# Altium schematic sheet 05_CONNECTOR_IN.SchDoc
size 420 x 297 mm; SheetNumber: 5; SheetTotal: 33
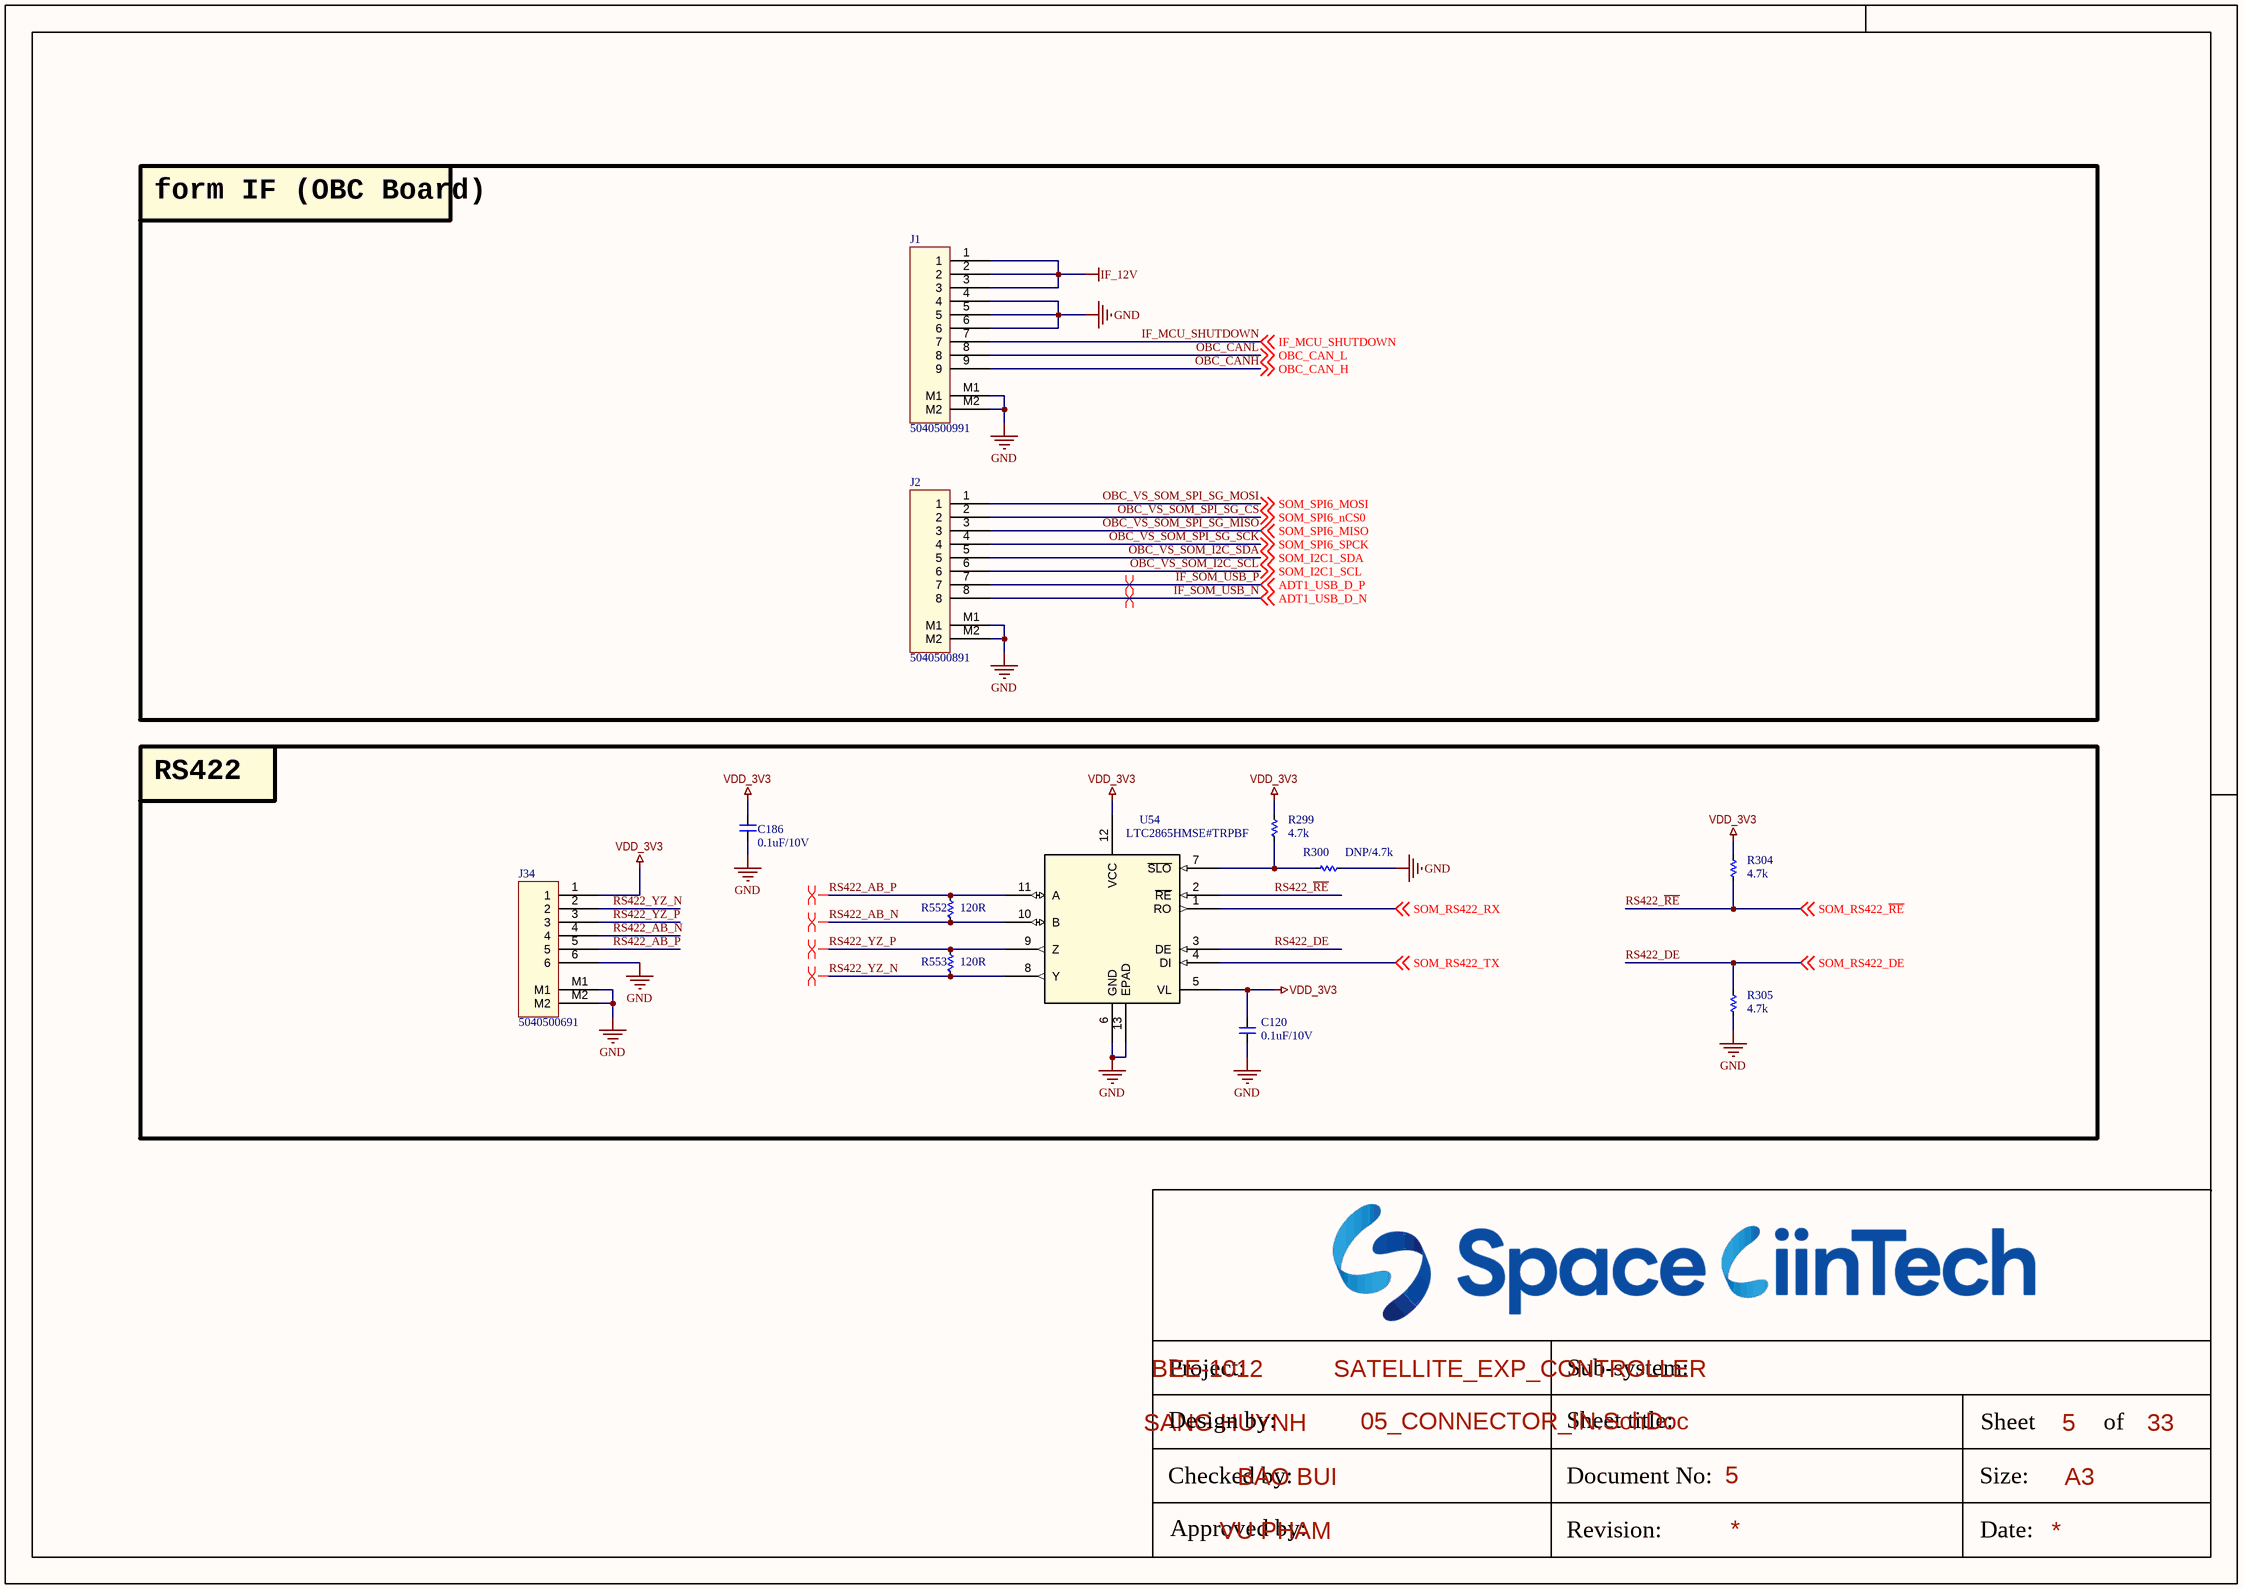
[diagram p0: 05_CONNECTOR_IN.SchDoc]

## Parts
C120  0.1uF/10V  [CAP_C_1005X50_L]
C186  0.1uF/10V  [CAP_C_1005X50_L]
J1  5040500991  [MOLEX_5040500991]
J2  5040500891  [MOLEX_5040500891]
J34  5040500691  [MOLEX_5040500691]
R299  4.7k  [RES_C_1005x30_L]
R300  DNP/4.7k  [RES_C_1005x30_L]
R304  4.7k  [RES_C_1005x30_L]
R305  4.7k  [RES_C_1005x30_L]
R552  120R  [RES_C_1005x30_L]
R553  120R  [RES_C_1005x30_L]
U54  LTC2865HMSE#TRPBF  [MSOP-12_MSE_LIT]

## Blocks framed on the sheet
form IF (OBC Board): J1 J2
RS422: C120 C186 J34 R299 R300 R304 R305 R552 R553 U54

## Nets
GND: C120.1 C186.1 J1.4 J1.5 J1.6 J1.M1 J1.M2 J2.M1 J2.M2 J34.6 J34.M1 J34.M2 R300.2 R305.1 U54.6(GND) U54.13(EPAD)
IF_12V: J1.1 J1.2 J1.3
VDD_3V3: C120.2 C186.2 J34.1 R299.1 R304.1 U54.5(VL) U54.12(VCC)
IF_MCU_SHUTDOWN: J1.7 ; off-sheet IF_MCU_SHUTDOWN
IF_SOM_USB_N: J2.8 ; off-sheet ADT1_USB_D_N  [also labelled ADT1_USB_D_N]
IF_SOM_USB_P: J2.7 ; off-sheet ADT1_USB_D_P  [also labelled ADT1_USB_D_P]
OBC_CANH: J1.9 ; off-sheet OBC_CAN_H  [also labelled OBC_CAN_H]
OBC_CANL: J1.8 ; off-sheet OBC_CAN_L  [also labelled OBC_CAN_L]
OBC_VS_SOM_I2C_SCL: J2.6 ; off-sheet SOM_I2C1_SCL  [also labelled SOM_I2C1_SCL]
OBC_VS_SOM_I2C_SDA: J2.5 ; off-sheet SOM_I2C1_SDA  [also labelled SOM_I2C1_SDA]
OBC_VS_SOM_SPI_SG_CS: J2.2 ; off-sheet SOM_SPI6_nCS0  [also labelled SOM_SPI6_nCS0]
OBC_VS_SOM_SPI_SG_MISO: J2.3 ; off-sheet SOM_SPI6_MISO  [also labelled SOM_SPI6_MISO]
OBC_VS_SOM_SPI_SG_MOSI: J2.1 ; off-sheet SOM_SPI6_MOSI  [also labelled SOM_SPI6_MOSI]
OBC_VS_SOM_SPI_SG_SCK: J2.4 ; off-sheet SOM_SPI6_SPCK  [also labelled SOM_SPI6_SPCK]
RS422_AB_N: J34.4 R552.2 U54.10(B)
RS422_AB_P: J34.5 R552.1 U54.11(A)
RS422_DE: R305.2 U54.3(DE) ; off-sheet SOM_RS422_DE  [also labelled SOM_RS422_DE]
RS422_~{RE}: R304.2 U54.2(~{RE}) ; off-sheet SOM_RS422_~{RE}  [also labelled SOM_RS422_~{RE}]
RS422_YZ_N: J34.2 R553.2 U54.8(Y)
RS422_YZ_P: J34.3 R553.1 U54.9(Z)
SOM_RS422_RX: U54.1(RO) ; off-sheet SOM_RS422_RX
SOM_RS422_TX: U54.4(DI) ; off-sheet SOM_RS422_TX
NetR299_2: R299.2 R300.1 U54.7(~{SLO})

## Layout directives
differential pair: IF_SOM_USB_N, IF_SOM_USB_P, RS422_AB_N, RS422_AB_P, RS422_YZ_N, RS422_YZ_P

## Notes on the sheet
- Project:
- BEE-1012
- Sub-system:
- SATELLITE_EXP_CONTROLLER
- Design by:
- SANG HUYNH
- BAO BUI
- Sheet title:
- Sheet
- A3
- of
- Checked by:
- Approved by:
- VU PHAM
- Revision:
- Document No:
- Size:
- Date:

## Library data of the parts
C120 C186 = _CAP_C_2: CAP CHIP
J1 = Header 9x1_2M
J2 = Header 8x1_2M
J34 = Header 6x1_2M
R299 R300 R304 R305 R552 R553 = _RES_B_2: RES
U54 = LTC2865HMSETRPBF: Â±60V Fault Protected 3V to 5.5V RS485/RS422 Transceivers; Manufacturer_Name: Analog Devices Inc; Copyright: Copyright (C) 2025 Ultra Librarian. All rights reserved.; Manufacturer_Part_Number: LTC2865HMSE#TRPBF; RefDes: RefDes; Type: Type